# EAGLE design MOTORES-L293D (EAGLE 7.5.0)
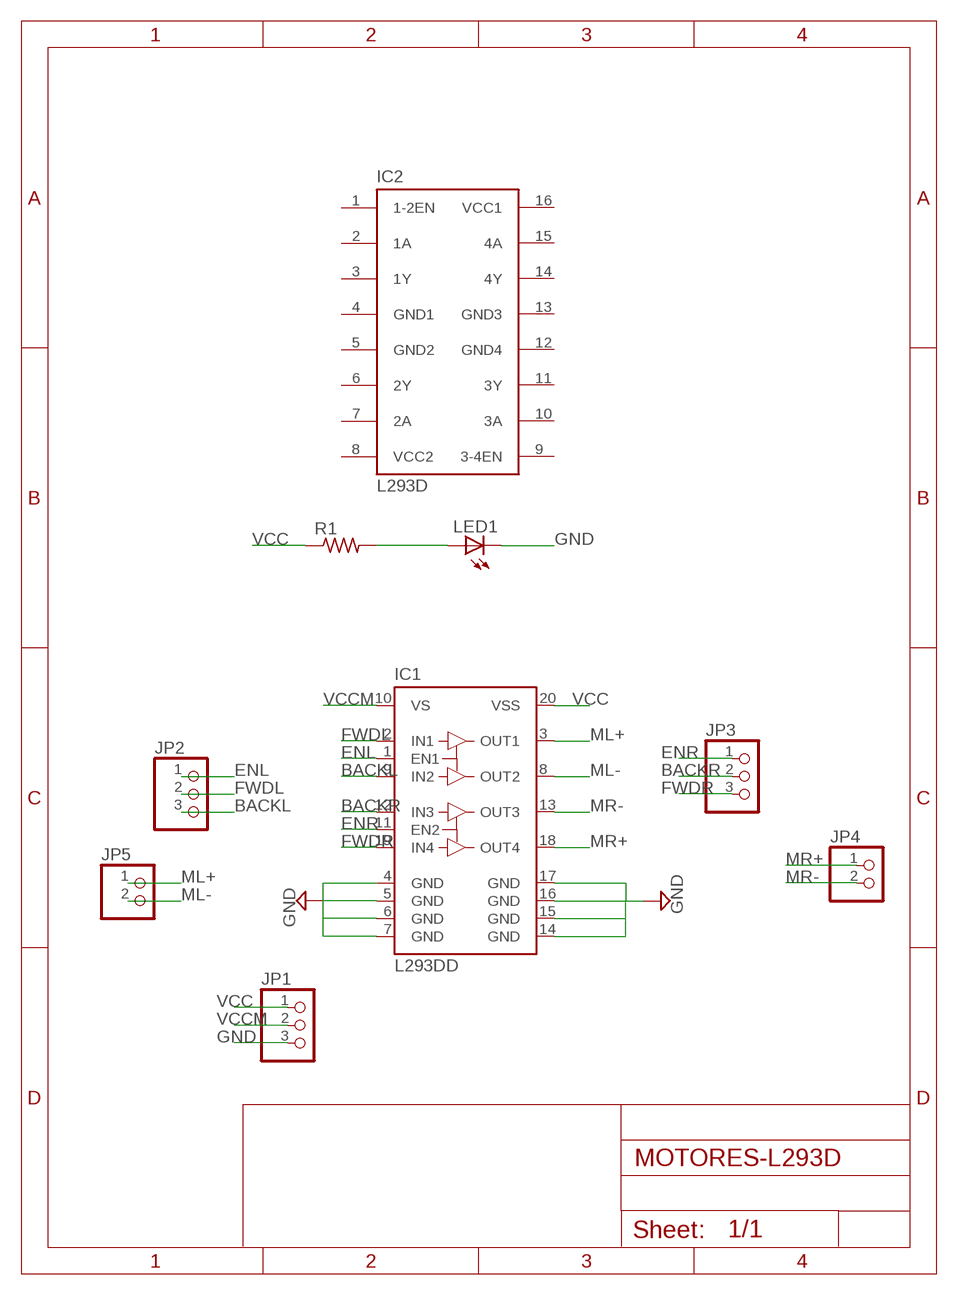
[diagram p0: schematic, sheet 1]

## Parts
IC1  L293DD  [SO20]
IC2  L293D  [DIL16]
JP1  PINHD-1X3  [1X03]
JP2  PINHD-1X3  [1X03]
JP3  PINHD-1X3  [1X03]
JP4  PINHD-1X2  [1X02]
JP5  PINHD-1X2  [1X02]
LED1  LED5MM  [LED5MM]
R1  R-US_R0603  [R0603]

## Nets
BACKL: IC1.9(IN2) JP2.3
BACKR: IC1.12(IN3) JP3.2
ENL: IC1.1(EN1) JP2.1
ENR: IC1.11(EN2) JP3.1
FWDL: IC1.2(IN1) JP2.2
FWDR: IC1.19(IN4) JP3.3
GND: IC1.4(GND) IC1.5(GND) IC1.6(GND) IC1.7(GND) IC1.14(GND) IC1.15(GND) IC1.16(GND) IC1.17(GND) JP1.3 LED1.K(C)
ML+: IC1.3(OUT1) JP5.1
ML-: IC1.8(OUT2) JP5.2
MR+: IC1.18(OUT4) JP4.1
MR-: IC1.13(OUT3) JP4.2
N$1: LED1.A R1.2
VCC: IC1.20(VSS) JP1.1 R1.1
VCCM: IC1.10(VS) JP1.2
Unconnected: IC2.1(1-2EN) IC2.2(1A) IC2.3(1Y) IC2.6(2Y) IC2.7(2A) IC2.9(3-4EN) IC2.10(3A) IC2.11(3Y) IC2.14(4Y) IC2.15(4A)

## Power pins joined to a net without a drawn wire
GND1: IC2.4(GND1)
GND2: IC2.5(GND2)
GND3: IC2.13(GND3)
GND4: IC2.12(GND4)
VCC1: IC2.16(VCC1)
VCC2: IC2.8(VCC2)

## Library data of the parts
IC1 = st-microelectronics:L293DD: PUSH-PULL FOUR CHANNEL DRIVER WITH DIODES Source: http://www.st.com/stonline/books/pdf/docs/1330.pdf; OC_FARNELL: unknown
IC2 = st-microelectronics:L293D: PUSH-PULL 4 CHANNEL DRIVER; MPN: L293D; OC_FARNELL: 9589619; OC_NEWARK: 56P8249
JP1-JP3 = pinhead:PINHD-1X3: PIN HEADER
JP4 JP5 = pinhead:PINHD-1X2: PIN HEADER
LED1 = led:LED: LED OSRAM: - CHIPLED LG R971, LG N971, LY N971, LG Q971, LY Q971, LO R971, LY R971 LH N974, LH R974 LS Q976, LO Q976, LY Q976 LO Q996 - Hyper CHIPLED LW Q18S LB Q993, LB Q99A, LB R99A - SideLED LS A670, LO A670, LY A670, LG A670, LP A670 LB A673, LV A673, LT A673, LW A673 LH A674 LY A675 LS A676, LA A676, LO A676, LY A676, LW A676 LS A679, LY A679, LG A679 - Hyper Micro SIDELED® LS Y876, LA Y876, LO Y876, LY Y876 LT Y87S - SmartLED LW L88C, LW L88S LB L89C, LB L89S, LG L890 LS L89K, LO L89K, LY L89K LS L896, LA L896, LO L896, LY L896 - TOPLED LS T670, LO T670, LY T670, LG T670, LP T670 LSG T670, LSP T670, LSY T670, LOP T670, LYG T670 LG T671, LOG T671, LSG T671 LB T673, LV T673, LT T673, LW T673 LH T674 LS T676, LA T676, LO T676, LY T676, LB T676, LH T676, LSB T676, LW T676 LB T67C, LV T67C, LT T67C, LS T67K, LO T67K, LY T67K, LW E67C LS E67B, LA E67B, LO E67B, LY E67B, LB E67C, LV E67C, LT E67C LW T67C LS T679, LY T679, LG T679 LS T770, LO T770, LY T770, LG T770, LP T770 LB T773, LV T773, LT T773, LW T773 LH T774 LS E675, LA E675, LY E675, LS T675 LS T776, LA T776, LO T776, LY T776, LB T776 LHGB T686 LT T68C, LB T68C - Hyper Mini TOPLED® LB M676 - Mini TOPLED Santana® LG M470 LS M47K, LO M47K, LY M47K Source: http://www.osram.convergy.de LUXEON: - LUMILED® LXK2-PW12-R00, LXK2-PW12-S00, LXK2-PW14-U00, LXK2-PW14-V00 LXK2-PM12-R00, LXK2-PM12-S00, LXK2-PM14-U00 LXK2-PE12-Q00, LXK2-PE12-R00, LXK2-PE12-S00, LXK2-PE14-T00, LXK2-PE14-U00 LXK2-PB12-K00, LXK2-PB12-L00, LXK2-PB12-M00, LXK2-PB14-N00, LXK2-PB14-P00, LXK2-PB14-Q00 LXK2-PR12-L00, LXK2-PR12-M00, LXK2-PR14-Q00, LXK2-PR14-R00 LXK2-PD12-Q00, LXK2-PD12-R00, LXK2-PD12-S00 LXK2-PH12-R00, LXK2-PH12-S00 LXK2-PL12-P00, LXK2-PL12-Q00, LXK2-PL12-R00 Source: www.luxeon.com KINGBRIGHT: KA-3528ASYC Source: www.kingbright.com
R1 = rcl:R-US_: RESISTOR, American symbol

## Board
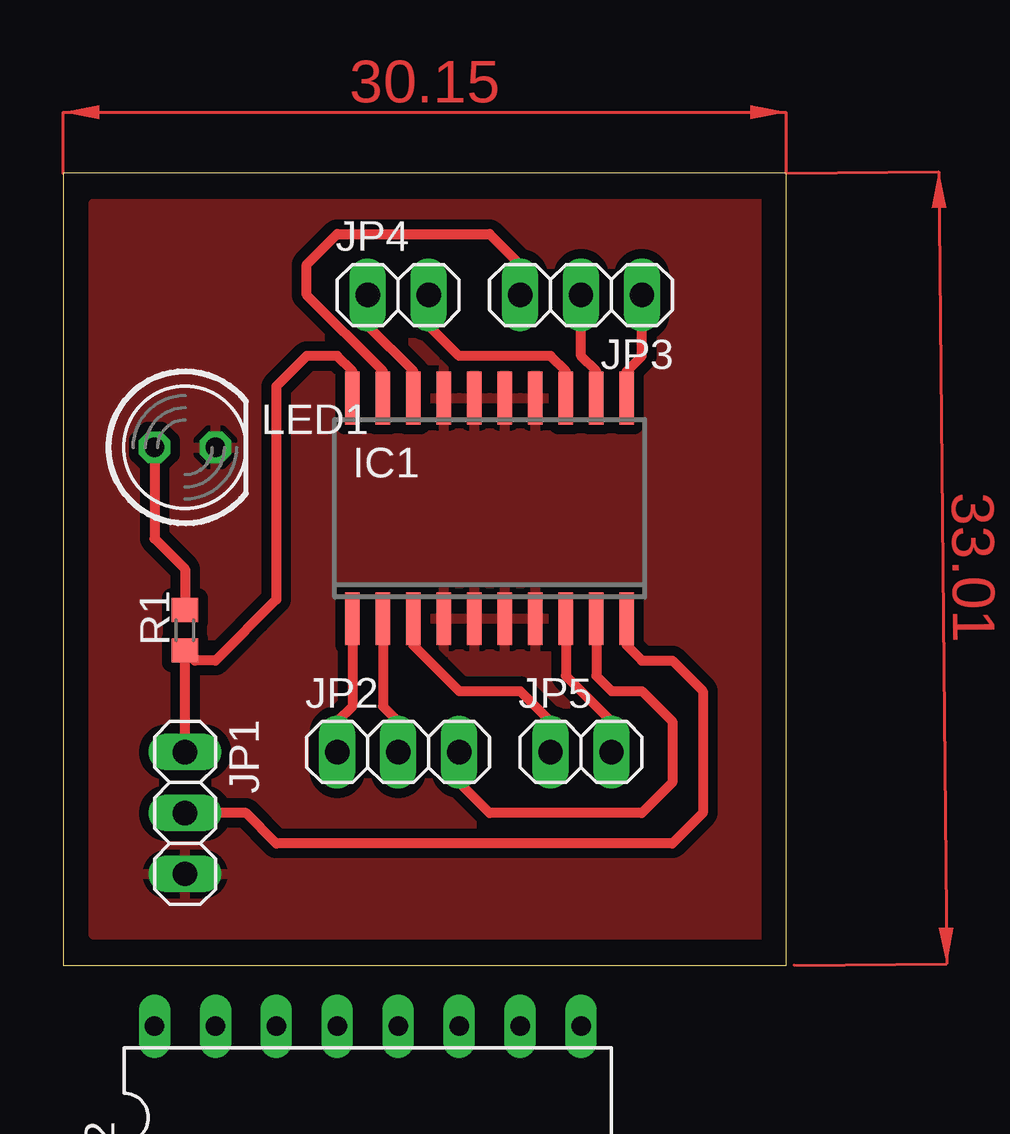
[diagram p1: board, top side]

Size 30.15 x 33.01 mm. Coordinates in mm from the lower left corner, seen from the top.
Outline: 0,0 30.15,0 30.15,33.01 0,33.01 0,0
Copper layers (1*16): Top 0.035mm / dielectric 1.5mm / Bottom 0.035mm
Design rules "default": minimum track width 10mil, minimum drill 24mil, track to track 8mil, track to pad 8mil, pad to pad 8mil, via to via 8mil, smd to smd 8mil, copper to edge 40mil, drill to drill 8mil, minimum pad ring 10mil, minimum via ring 8mil, stop-mask expansion 4mil, vias tented up to drill 0mil, thermal gap 10mil

### Footprints (pad centres in the part's own frame; a part is rotated, then mirrored left to right if it is on the bottom)
SO20 = smd 0.6 x 2.2: 1 -5.715,-4.6; 2 -4.445,-4.6; 3 -3.175,-4.6; 4 -1.905,-4.6; 5 -0.635,-4.6; 6 0.635,-4.6; 7 1.905,-4.6; 8 3.175,-4.6; 9 4.445,-4.6; 10 5.715,-4.6; 11 5.715,4.6; 12 4.445,4.6; 13 3.175,4.6; 14 1.905,4.6; 15 0.635,4.6; 16 -0.635,4.6; 17 -1.905,4.6; 18 -3.175,4.6; 19 -4.445,4.6; 20 -5.715,4.6
DIL16 = drill 0.813 long: 1 -8.89,-3.81; 2 -6.35,-3.81; 3 -3.81,-3.81; 4 -1.27,-3.81; 5 1.27,-3.81; 6 3.81,-3.81; 7 6.35,-3.81; 8 8.89,-3.81; 9 8.89,3.81; 10 6.35,3.81; 11 3.81,3.81; 12 1.27,3.81; 13 -1.27,3.81; 14 -3.81,3.81; 15 -6.35,3.81; 16 -8.89,3.81
1X03 = drill 1.016 long: 1 -2.54,0; 2 0,0; 3 2.54,0
1X02 = drill 1.016 long: 1 -1.27,0; 2 1.27,0
LED5MM = drill 0.813 octagon: A -1.27,0; K 1.27,0
R0603 = smd 1 x 1.1: 1 -0.85,0; 2 0.85,0

### Placement (x,y rotation side)
IC1  17.78,19.05 0 top
IC2  12.7,-6.35 0 top
JP1  5.08,6.35 270 top
JP2  13.97,8.89 0 top
JP3  21.59,27.94 180 top
JP4  13.97,27.94 0 top
JP5  21.59,8.89 0 top
LED1  5.08,21.59 0 top
R1  5.08,13.97 90 top

### Tracks (layer width: path | path; a pad name or v marks a point on that pad's centre or on a via)
BACKL
  Top 0.406: IC1.9 22.23,12.06 22.86,11.43 24.13,11.43 25.4,10.16 25.4,7.62 24.13,6.35 17.78,6.35 16.51,7.62 JP2.3
BACKR
  Top 0.406: IC1.12 22.23,24.77 21.59,25.4 JP3.2
ENL
  Top 0.406: IC1.1 12.06,10.79 11.43,10.16 JP2.1
ENR
  Top 0.406: IC1.11 23.5,24.77 24.13,25.4 JP3.1
FWDL
  Top 0.406: IC1.2 13.34,10.79 13.97,10.16 JP2.2
FWDR
  Top 0.406: IC1.19 13.34,24.77 10.16,27.94 10.16,29.21 11.43,30.48 17.78,30.48 19.05,29.21 JP3.3
GND
  pour Top (isolate 0.406): 1.27,31.75 29.21,31.75 29.21,1.27 1.27,1.27
ML+
  Top 0.406: IC1.3 14.61,13.34 16.51,11.43 19.05,11.43 20.32,10.16 JP5.1
ML-
  Top 0.406: IC1.8 20.95,12.06 22.86,10.16 JP5.2
MR+
  Top 0.406: IC1.18 14.61,24.77 12.7,26.67 JP4.1
MR-
  Top 0.406: IC1.13 20.95,24.77 20.32,25.4 16.51,25.4 15.24,26.67 JP4.2
N$1
  Top 0.406: LED1.A 3.81,17.78 5.08,16.51 R1.2
VCC
  Top 0.406: JP1.1 R1.1 5.5,12.7 6.35,12.7 8.89,15.24 8.89,24.13 10.16,25.4 11.43,25.4 12.06,24.77 IC1.20
VCCM
  Top 0.406: IC1.10 23.5,13.34 24.13,12.7 25.4,12.7 26.67,11.43 26.67,6.35 25.4,5.08 8.89,5.08 7.62,6.35 JP1.2
(copper drawn outside any net)
  shapes: Top area x2